# EAGLE design untitled (EAGLE 6.1)
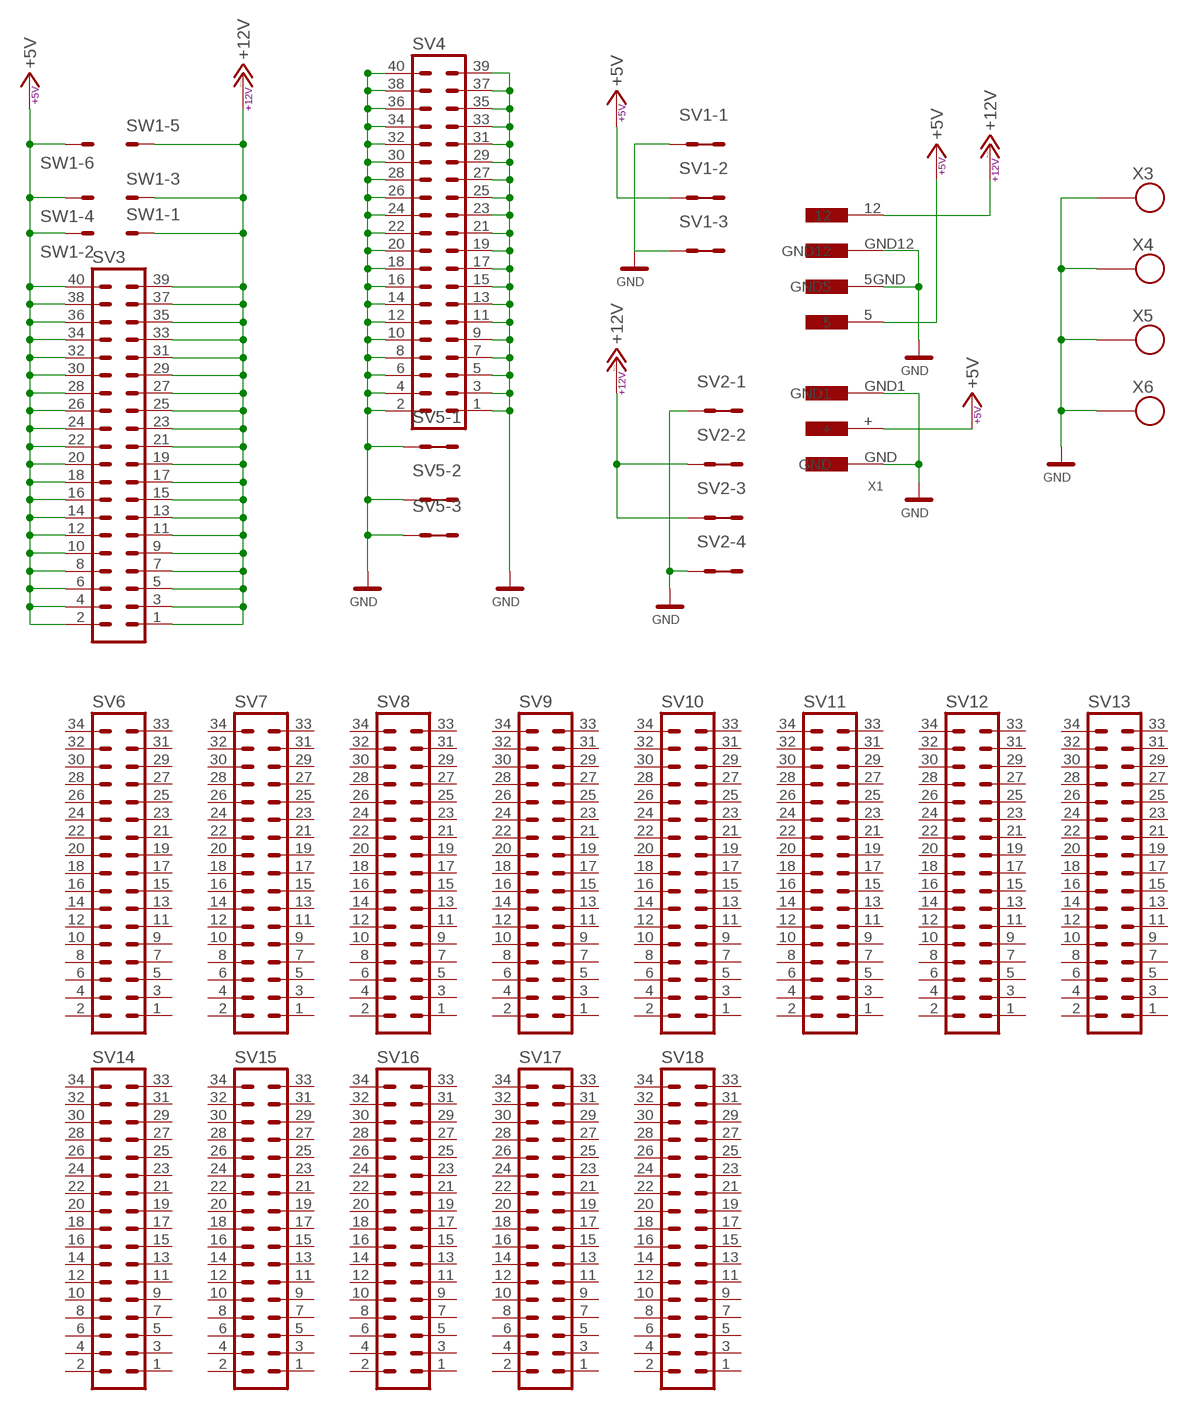
[diagram p0: schematic, sheet 1]

## Parts
SV1  MA03-2  [MA03-2]
SV2  MA04-2  [MA04-2]
SV3  MA20-2  [MA20-2]
SV4  MA20-2  [MA20-2]
SV5  MA03-2  [MA03-2]
SV6  MA17-2  [MA17-2]
SV7  MA17-2  [MA17-2]
SV8  MA17-2  [MA17-2]
SV9  MA17-2  [MA17-2]
SV10  MA17-2  [MA17-2]
SV11  MA17-2  [MA17-2]
SV12  MA17-2  [MA17-2]
SV13  MA17-2  [MA17-2]
SV14  MA17-2  [MA17-2]
SV15  MA17-2  [MA17-2]
SV16  MA17-2  [MA17-2]
SV17  MA17-2  [MA17-2]
SV18  MA17-2  [MA17-2]
SW1  MA03-3  [MA03-2]
X1  KONEKTOR_DC_2.1MM  [KONEKTOR_DC_2.1MM]
X2  POWER_HDD  [POWER_HDD]
X3  SROUB3M  [SROUB3M]
X4  SROUB3M  [SROUB3M]
X5  SROUB3M  [SROUB3M]
X6  SROUB3M  [SROUB3M]

## Nets
+5V: SV1.3 SV1.4 SV3.2 SV3.4 SV3.6 SV3.8 SV3.10 SV3.12 SV3.14 SV3.16 SV3.18 SV3.20 SV3.22 SV3.24 SV3.26 SV3.28 SV3.30 SV3.32 SV3.34 SV3.36 SV3.38 SV3.40 SW1.2 SW1.4 SW1.6 X1.+ X2.5
+12V: SV2.3 SV2.4 SV2.5 SV2.6 SV3.1 SV3.3 SV3.5 SV3.7 SV3.9 SV3.11 SV3.13 SV3.15 SV3.17 SV3.19 SV3.21 SV3.23 SV3.25 SV3.27 SV3.29 SV3.31 SV3.33 SV3.35 SV3.37 SV3.39 SW1.1 SW1.3 SW1.5 X2.12
GND: SV1.1 SV1.2 SV1.5 SV1.6 SV2.1 SV2.2 SV2.7 SV2.8 SV4.1 SV4.2 SV4.3 SV4.4 SV4.5 SV4.6 SV4.7 SV4.8 SV4.9 SV4.10 SV4.11 SV4.12 SV4.13 SV4.14 SV4.15 SV4.16 SV4.17 SV4.18 SV4.19 SV4.20 SV4.21 SV4.22 SV4.23 SV4.24 SV4.25 SV4.26 SV4.27 SV4.28 SV4.29 SV4.30 SV4.31 SV4.32 SV4.33 SV4.34 SV4.35 SV4.36 SV4.37 SV4.38 SV4.39 SV4.40 SV5.1 SV5.2 SV5.3 SV5.4 SV5.5 SV5.6 X1.GND X1.GND1 X2.5GND(GND5) X2.GND12 X3.P$1 X4.P$1 X5.P$1 X6.P$1
Unconnected: SV6.1 SV6.2 SV6.3 SV6.4 SV6.5 SV6.6 SV6.7 SV6.8 SV6.9 SV6.10 SV6.11 SV6.12 SV6.13 SV6.14 SV6.15 SV6.16 SV6.17 SV6.18 SV6.19 SV6.20 SV6.21 SV6.22 SV6.23 SV6.24 SV6.25 SV6.26 SV6.27 SV6.28 SV6.29 SV6.30 SV6.31 SV6.32 SV6.33 SV6.34 SV7.1 SV7.2 SV7.3 SV7.4 SV7.5 SV7.6 SV7.7 SV7.8 SV7.9 SV7.10 SV7.11 SV7.12 SV7.13 SV7.14 SV7.15 SV7.16 SV7.17 SV7.18 SV7.19 SV7.20 SV7.21 SV7.22 SV7.23 SV7.24 SV7.25 SV7.26 SV7.27 SV7.28 SV7.29 SV7.30 SV7.31 SV7.32 SV7.33 SV7.34 SV8.1 SV8.2 SV8.3 SV8.4 SV8.5 SV8.6 SV8.7 SV8.8 SV8.9 SV8.10 SV8.11 SV8.12 SV8.13 SV8.14 SV8.15 SV8.16 SV8.17 SV8.18 SV8.19 SV8.20 SV8.21 SV8.22 SV8.23 SV8.24 SV8.25 SV8.26 SV8.27 SV8.28 SV8.29 SV8.30 SV8.31 SV8.32 SV8.33 SV8.34 SV9.1 SV9.2 SV9.3 SV9.4 SV9.5 SV9.6 SV9.7 SV9.8 SV9.9 SV9.10 SV9.11 SV9.12 SV9.13 SV9.14 SV9.15 SV9.16 SV9.17 SV9.18 SV9.19 SV9.20 SV9.21 SV9.22 SV9.23 SV9.24 SV9.25 SV9.26 SV9.27 SV9.28 SV9.29 SV9.30 SV9.31 SV9.32 SV9.33 SV9.34 SV10.1 SV10.2 SV10.3 SV10.4 SV10.5 SV10.6 SV10.7 SV10.8 SV10.9 SV10.10 SV10.11 SV10.12 SV10.13 SV10.14 SV10.15 SV10.16 SV10.17 SV10.18 SV10.19 SV10.20 SV10.21 SV10.22 SV10.23 SV10.24 SV10.25 SV10.26 SV10.27 SV10.28 SV10.29 SV10.30 SV10.31 SV10.32 SV10.33 SV10.34 SV11.1 SV11.2 SV11.3 SV11.4 SV11.5 SV11.6 SV11.7 SV11.8 SV11.9 SV11.10 SV11.11 SV11.12 SV11.13 SV11.14 SV11.15 SV11.16 SV11.17 SV11.18 SV11.19 SV11.20 SV11.21 SV11.22 SV11.23 SV11.24 SV11.25 SV11.26 SV11.27 SV11.28 SV11.29 SV11.30 SV11.31 SV11.32 SV11.33 SV11.34 SV12.1 SV12.2 SV12.3 SV12.4 SV12.5 SV12.6 SV12.7 SV12.8 SV12.9 SV12.10 SV12.11 SV12.12 SV12.13 SV12.14 SV12.15 SV12.16 SV12.17 SV12.18 SV12.19 SV12.20 SV12.21 SV12.22 SV12.23 SV12.24 SV12.25 SV12.26 SV12.27 SV12.28 SV12.29 SV12.30 SV12.31 SV12.32 SV12.33 SV12.34 SV13.1 SV13.2 SV13.3 SV13.4 SV13.5 SV13.6 SV13.7 SV13.8 SV13.9 SV13.10 SV13.11 SV13.12 SV13.13 SV13.14 SV13.15 SV13.16 SV13.17 SV13.18 SV13.19 SV13.20 SV13.21 SV13.22 SV13.23 SV13.24 SV13.25 SV13.26 SV13.27 SV13.28 SV13.29 SV13.30 SV13.31 SV13.32 SV13.33 SV13.34 SV14.1 SV14.2 SV14.3 SV14.4 SV14.5 SV14.6 SV14.7 SV14.8 SV14.9 SV14.10 SV14.11 SV14.12 SV14.13 SV14.14 SV14.15 SV14.16 SV14.17 SV14.18 SV14.19 SV14.20 SV14.21 SV14.22 SV14.23 SV14.24 SV14.25 SV14.26 SV14.27 SV14.28 SV14.29 SV14.30 SV14.31 SV14.32 SV14.33 SV14.34 SV15.1 SV15.2 SV15.3 SV15.4 SV15.5 SV15.6 SV15.7 SV15.8 SV15.9 SV15.10 SV15.11 SV15.12 SV15.13 SV15.14 SV15.15 SV15.16 SV15.17 SV15.18 SV15.19 SV15.20 SV15.21 SV15.22 SV15.23 SV15.24 SV15.25 SV15.26 SV15.27 SV15.28 SV15.29 SV15.30 SV15.31 SV15.32 SV15.33 SV15.34 SV16.1 SV16.2 SV16.3 SV16.4 SV16.5 SV16.6 SV16.7 SV16.8 SV16.9 SV16.10 SV16.11 SV16.12 SV16.13 SV16.14 SV16.15 SV16.16 SV16.17 SV16.18 SV16.19 SV16.20 SV16.21 SV16.22 SV16.23 SV16.24 SV16.25 SV16.26 SV16.27 SV16.28 SV16.29 SV16.30 SV16.31 SV16.32 SV16.33 SV16.34 SV17.1 SV17.2 SV17.3 SV17.4 SV17.5 SV17.6 SV17.7 SV17.8 SV17.9 SV17.10 SV17.11 SV17.12 SV17.13 SV17.14 SV17.15 SV17.16 SV17.17 SV17.18 SV17.19 SV17.20 SV17.21 SV17.22 SV17.23 SV17.24 SV17.25 SV17.26 SV17.27 SV17.28 SV17.29 SV17.30 SV17.31 SV17.32 SV17.33 SV17.34 SV18.1 SV18.2 SV18.3 SV18.4 SV18.5 SV18.6 SV18.7 SV18.8 SV18.9 SV18.10 SV18.11 SV18.12 SV18.13 SV18.14 SV18.15 SV18.16 SV18.17 SV18.18 SV18.19 SV18.20 SV18.21 SV18.22 SV18.23 SV18.24 SV18.25 SV18.26 SV18.27 SV18.28 SV18.29 SV18.30 SV18.31 SV18.32 SV18.33 SV18.34

## Library data of the parts
SV1 SV5 = moje_hrebinky:MA03-2: PIN HEADER; OC_FARNELL: unknown; OC_NEWARK: unknown
SV2 = moje_hrebinky:MA04-2: PIN HEADER; OC_FARNELL: unknown; OC_NEWARK: unknown
SV3 SV4 = moje_hrebinky:MA20-2: PIN HEADER; OC_FARNELL: unknown; OC_NEWARK: unknown
SV6-SV18 = moje_hrebinky:MA17-2: PIN HEADER; OC_FARNELL: unknown; OC_NEWARK: unknown
SW1 = moje_hrebinky:MA03-3
X1 = moje:KONEKTOR_DC_2.1MM: KONEKTOR DC 2.1MM
X2 = moje:POWER_HDD
X3-X6 = moje:SROUB3M

## Board
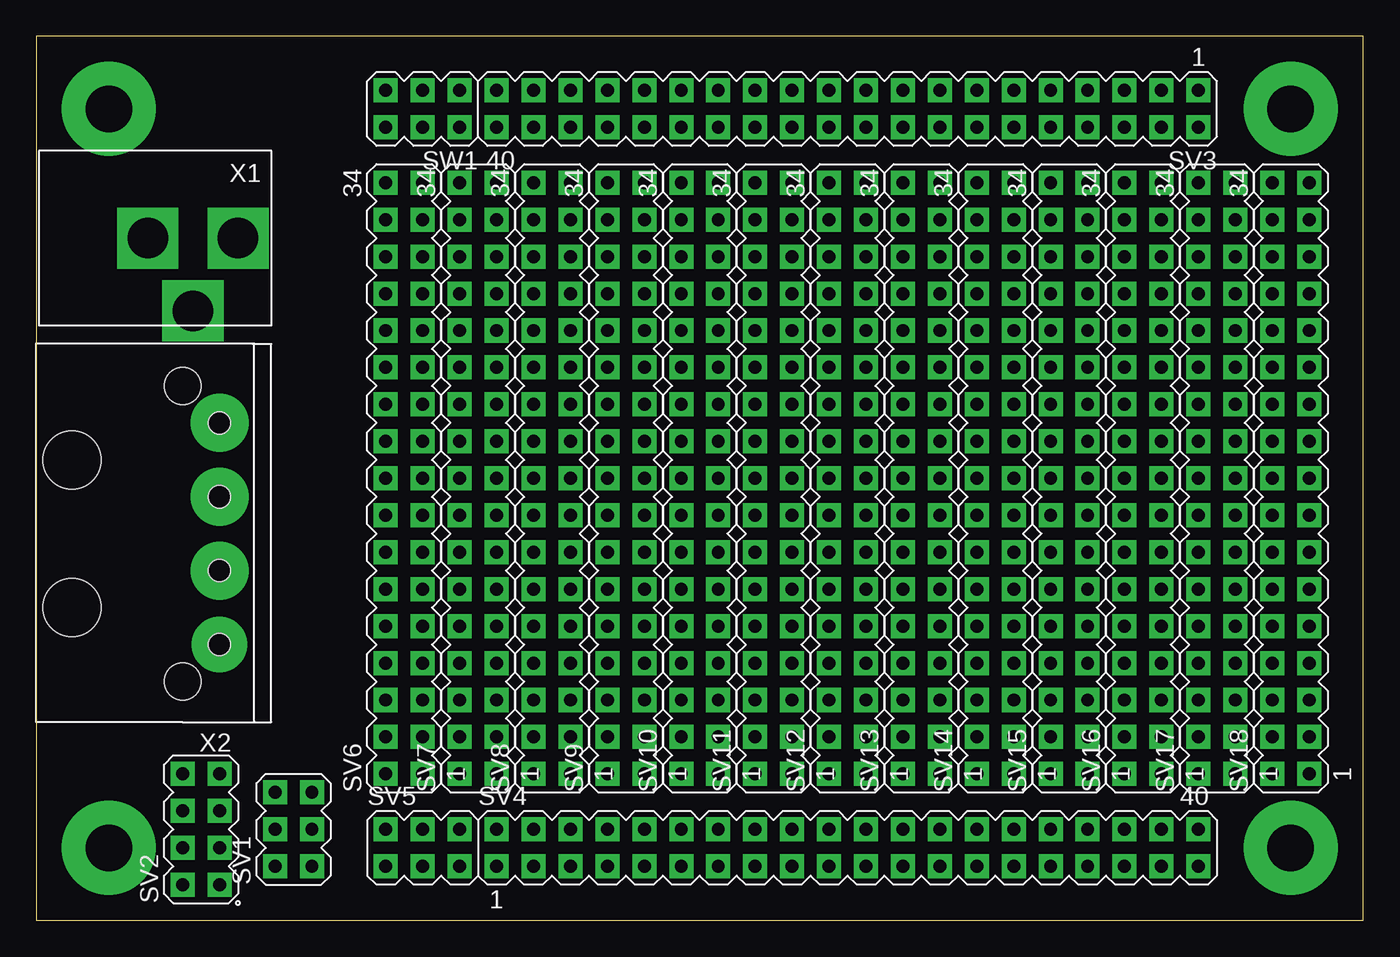
[diagram p1: board, top side]
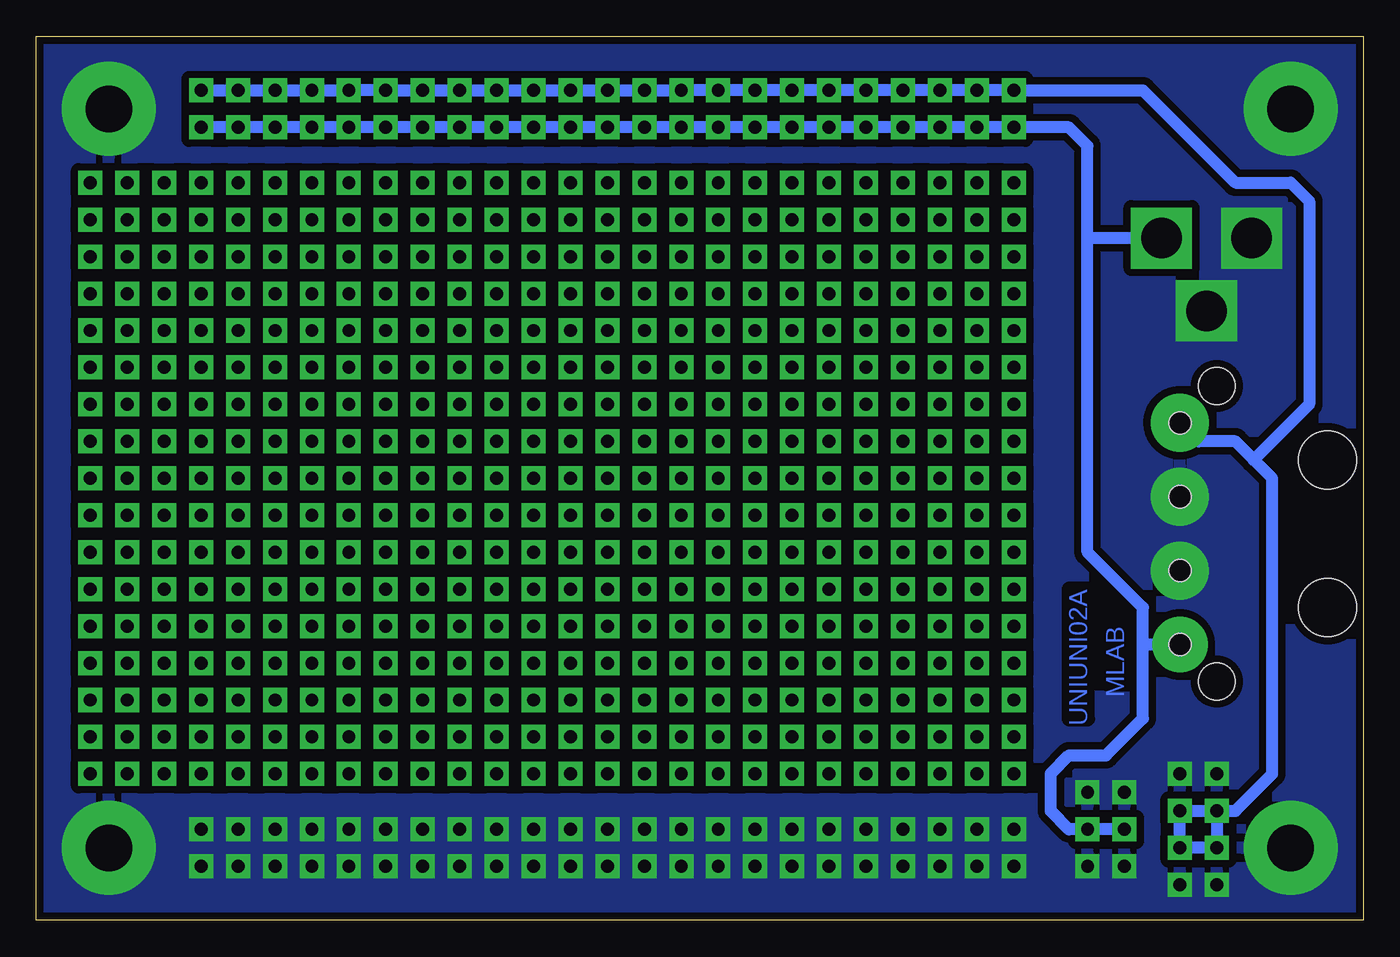
[diagram p2: board, bottom side, seen from below]

Size 91.24 x 60.76 mm. Coordinates in mm from the lower left corner, seen from the top.
Outline: 0,0 91.24,0 91.24,60.76 0,60.76 0,0
Copper layers (1*16): Top 0.035mm / dielectric 1mm / Bottom 0.035mm
Design rules: minimum track width 12mil, minimum drill 24mil, track to track 20mil, track to pad 20mil, pad to pad 20mil, via to via 20mil, smd to smd 8mil, copper to edge 20mil, drill to drill 70mil, minimum pad ring 10mil, minimum via ring 8mil, stop-mask expansion 5mil, vias tented up to drill 0mil, thermal gap 0mil

### Footprints (pad centres in the part's own frame; a part is rotated, then mirrored left to right if it is on the bottom)
MA03-2 = drill 0.889 pad 1.651 square: 1 -2.54,-1.27; 2 -2.54,1.27; 3 0,-1.27; 4 0,1.27; 5 2.54,-1.27; 6 2.54,1.27
MA04-2 = drill 0.889 pad 1.651 square: 1 -3.81,-1.27; 2 -3.81,1.27; 3 -1.27,-1.27; 4 -1.27,1.27; 5 1.27,-1.27; 6 1.27,1.27; 7 3.81,-1.27; 8 3.81,1.27
MA20-2 = drill 0.889 pad 1.651 square: 1 -24.13,-1.27; 2 -24.13,1.27; 3 -21.59,-1.27; 4 -21.59,1.27; 5 -19.05,-1.27; 6 -19.05,1.27; 7 -16.51,-1.27; 8 -16.51,1.27; 9 -13.97,-1.27; 10 -13.97,1.27; 11 -11.43,-1.27; 12 -11.43,1.27; 13 -8.89,-1.27; 14 -8.89,1.27; 15 -6.35,-1.27; 16 -6.35,1.27; 17 -3.81,-1.27; 18 -3.81,1.27; 19 -1.27,-1.27; 20 -1.27,1.27; 21 1.27,-1.27; 22 1.27,1.27; 23 3.81,-1.27; 24 3.81,1.27; 25 6.35,-1.27; 26 6.35,1.27; 27 8.89,-1.27; 28 8.89,1.27; 29 11.43,-1.27; 30 11.43,1.27; 31 13.97,-1.27; 32 13.97,1.27; 33 16.51,-1.27; 34 16.51,1.27; 35 19.05,-1.27; 36 19.05,1.27; 37 21.59,-1.27; 38 21.59,1.27; 39 24.13,-1.27; 40 24.13,1.27
MA17-2 = drill 0.889 pad 1.651 square: 1 -20.32,-1.27; 2 -20.32,1.27; 3 -17.78,-1.27; 4 -17.78,1.27; 5 -15.24,-1.27; 6 -15.24,1.27; 7 -12.7,-1.27; 8 -12.7,1.27; 9 -10.16,-1.27; 10 -10.16,1.27; 11 -7.62,-1.27; 12 -7.62,1.27; 13 -5.08,-1.27; 14 -5.08,1.27; 15 -2.54,-1.27; 16 -2.54,1.27; 17 0,-1.27; 18 0,1.27; 19 2.54,-1.27; 20 2.54,1.27; 21 5.08,-1.27; 22 5.08,1.27; 23 7.62,-1.27; 24 7.62,1.27; 25 10.16,-1.27; 26 10.16,1.27; 27 12.7,-1.27; 28 12.7,1.27; 29 15.24,-1.27; 30 15.24,1.27; 31 17.78,-1.27; 32 17.78,1.27; 33 20.32,-1.27; 34 20.32,1.27
KONEKTOR_DC_2.1MM = drill 2.8 square: + 0,0; GND 3.1,5; GND1 6.2,0
POWER_HDD = drill 1.5 pad 3.81: 5 -2.54,-10.16 | drill 1.5 pad 4: 5GND 2.54,-10.16; 12 12.7,-10.16; GND12 7.62,-10.16 | hole 3.99: 0,0; 10.16,0 | hole 2.54: -5.08,-7.62; 15.24,-7.62 | hole 1.52: -2.54,-10.16; 2.54,-10.16; 7.62,-10.16; 12.7,-10.16
SROUB3M = drill 3.2 pad 6.452: P$1 0,0

### Placement (x,y rotation side)
SV1  17.68,6.25 90 top
SV2  11.33,6.25 90 top
SV3  55.78,55.78 180 top
SV4  55.78,4.98 0 top
SV5  26.57,4.98 0 top
SV6  25.3,30.38 90 top
SV7  30.38,30.38 90 top
SV8  35.46,30.38 90 top
SV9  40.54,30.38 90 top
SV10  45.62,30.38 90 top
SV11  50.7,30.38 90 top
SV12  55.78,30.38 90 top
SV13  60.86,30.38 90 top
SV14  65.94,30.38 90 top
SV15  71.02,30.38 90 top
SV16  76.1,30.38 90 top
SV17  81.18,30.38 90 top
SV18  86.26,30.38 90 top
SW1  26.57,55.78 180 top
X1  13.87,46.89 180 top
X2  2.44,21.49 90 top
X3  4.98,55.78 0 top
X4  86.26,55.78 0 top
X5  86.26,4.98 0 top
X6  4.98,4.98 0 top

### Tracks (layer width: path | path; a pad name or v marks a point on that pad's centre or on a via)
+5V
  Bottom 0.813: 15.14,18.95 15.14,21.49 18.95,25.3 18.95,46.89 | 18.95,46.89 18.95,53.24 20.22,54.51 SW1.6 SW1.4 SW1.2 SV3.40 SV3.38 SV3.36 SV3.34 SV3.32 SV3.30 SV3.28 SV3.26 SV3.24 SV3.22 SV3.20 SV3.18 SV3.16 SV3.14 SV3.12 SV3.10 SV3.8 SV3.6 SV3.4 SV3.2 | X1.+ 18.95,46.89 | X2.5 15.14,18.95 | SV1.3 SV1.4 20.22,6.25 21.49,7.52 21.49,10.06 20.22,11.33 17.68,11.33 15.14,13.87 15.14,18.95
+12V
  Bottom 0.813: SV2.6 SV2.4 SV2.3 SV2.5 8.79,7.52 6.25,10.06 6.25,30.38 7.52,31.65 | 7.52,31.65 8.79,32.92 11.33,32.92 X2.12 | 7.52,31.65 3.71,35.46 3.71,49.43 4.98,50.7 8.79,50.7 15.14,57.05 SW1.5 SW1.3 SW1.1 SV3.39 SV3.37 SV3.35 SV3.33 SV3.31 SV3.29 SV3.27 SV3.25 SV3.23 SV3.21 SV3.19 SV3.17 SV3.15 SV3.13 SV3.11 SV3.9 SV3.7 SV3.5 SV3.3 SV3.1
GND
  pour Bottom: -0.1,60.86 -0.1,-0.1 91.34,-0.1 91.34,60.86

### Text on the board
Bottom: UNIUNI02A | MLAB